# Altium schematic sheet Audio.SchDoc
size B; SheetNumber: 6; SheetTotal: 8
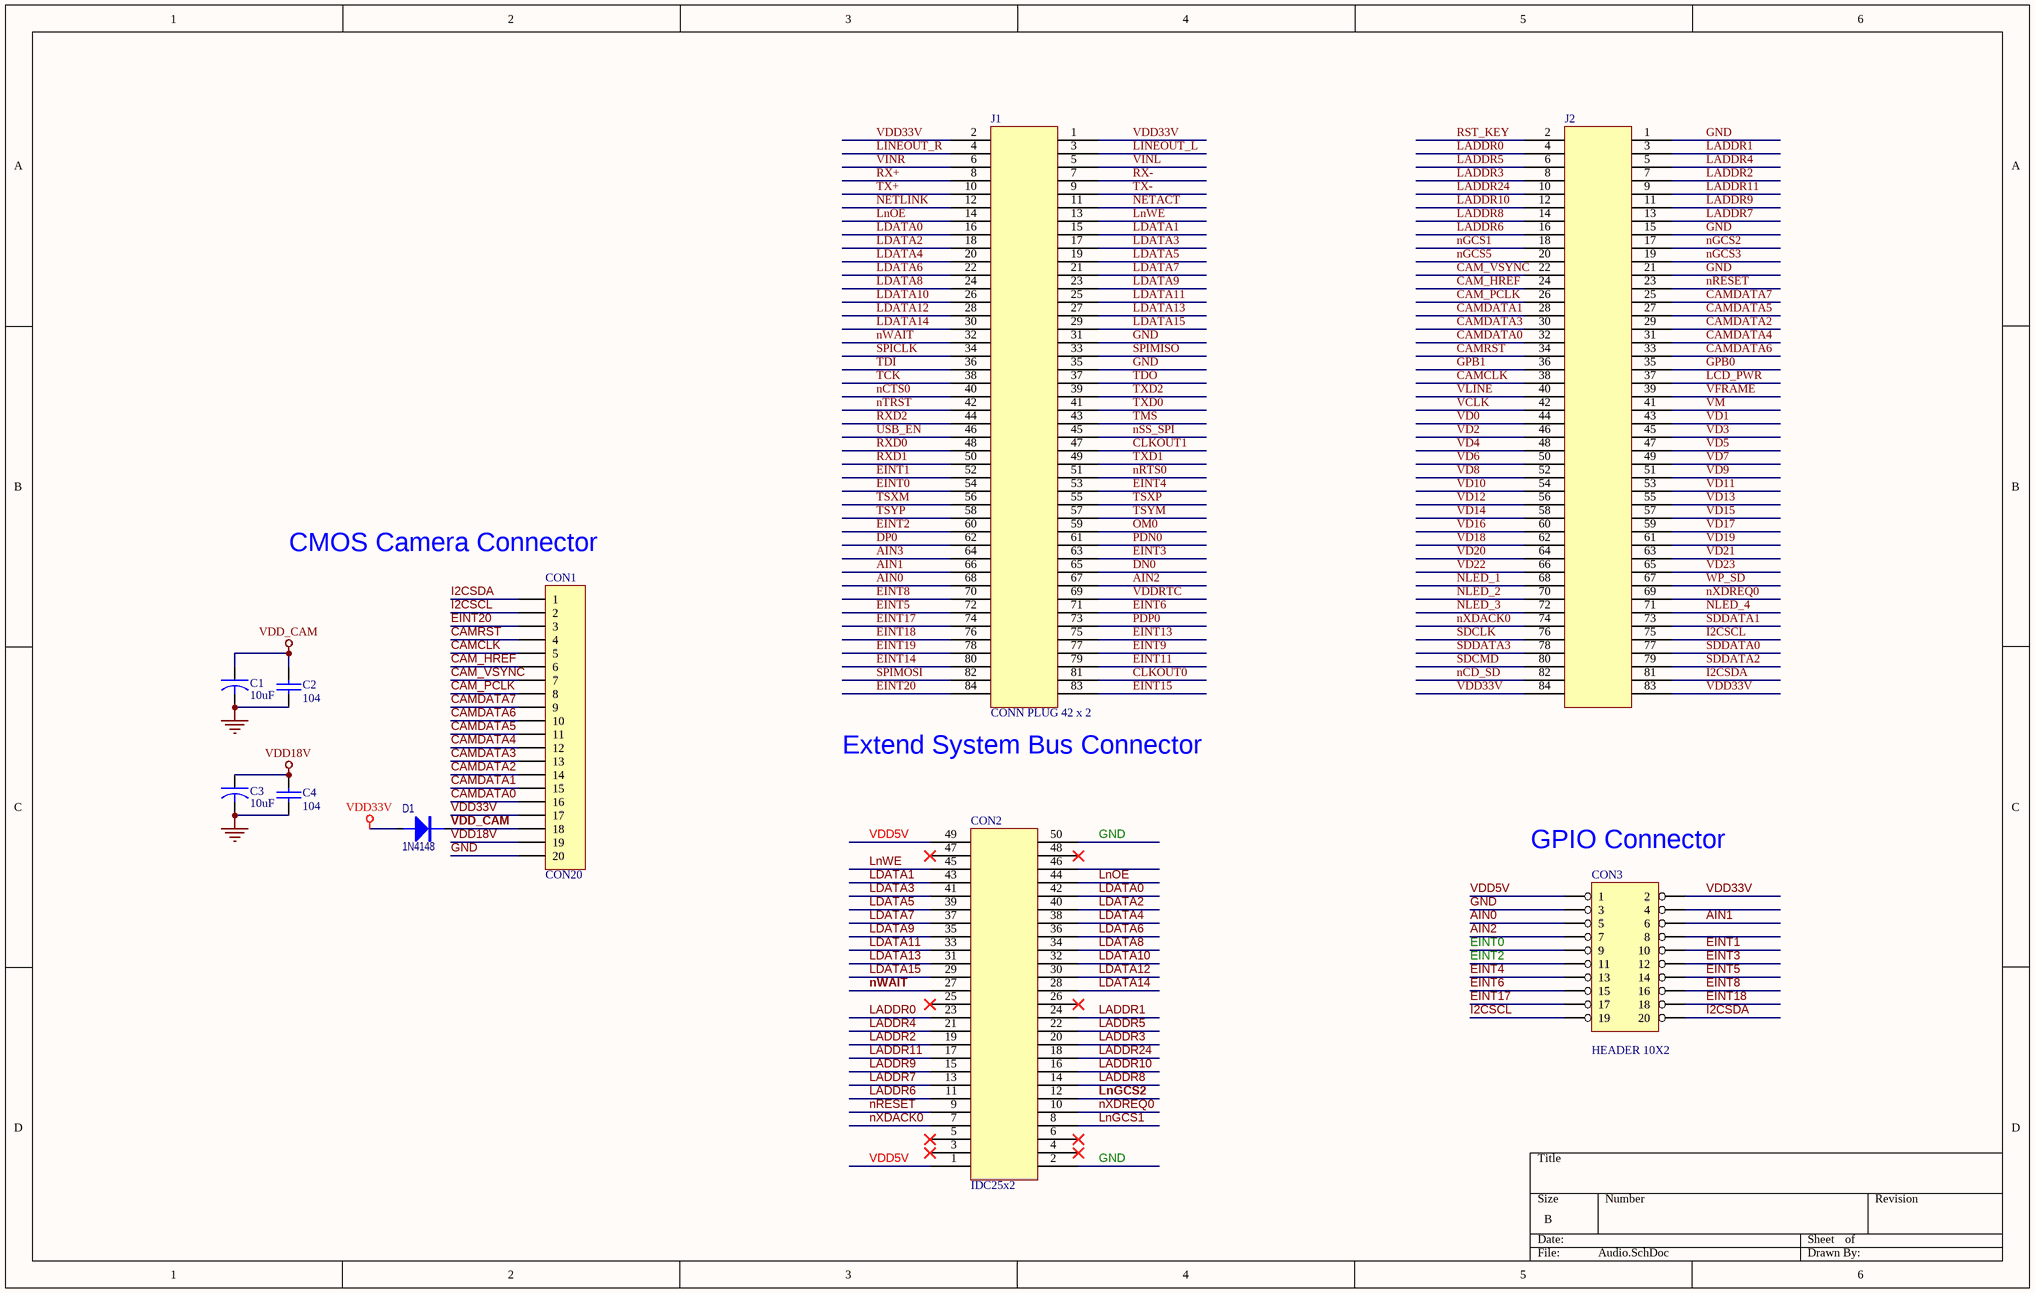
[diagram p0: Audio.SchDoc]

## Parts
C1  10uF  [3216A]
C2  104  [0603A]
C3  10uF  [3216A]
C4  104  [0603A]
CON1  CON20  [IDC20SS]
CON2  IDC25x2  [IDC25X2]
CON3  HEADER 10X2  [IDC20SS]
D1  1N4148  [D1206]
J1  CONN PLUG 42 x 2  [DIP84]
J2  CONN PLUG 42 x 2  [DIP84]  (value not drawn)

## Nets
GND: C1.2 C2.2 C3.2 C4.2 CON1.20 CON2.2 CON2.50 CON3.3 J1.31 J1.35 J2.1 J2.15 J2.21
VDD18V: C3.1 C4.1 CON1.19
VDD33V: CON1.17 CON3.2 D1.1 J1.1 J1.2 J2.83 J2.84
VDD_CAM: C1.1 C2.1 CON1.18 D1.2
AIN0: CON3.5 J1.68
AIN1: CON3.6 J1.66
AIN2: CON3.7 J1.67
AIN3: J1.64
CAM_HREF: CON1.6 J2.24
CAM_PCLK: CON1.8 J2.26
CAM_VSYNC: CON1.7 J2.22
CAMCLK: CON1.5 J2.38
CAMDATA0: CON1.16 J2.32
CAMDATA1: CON1.15 J2.28
CAMDATA2: CON1.14 J2.29
CAMDATA3: CON1.13 J2.30
CAMDATA4: CON1.12 J2.31
CAMDATA5: CON1.11 J2.27
CAMDATA6: CON1.10 J2.33
CAMDATA7: CON1.9 J2.25
CAMRST: CON1.4 J2.34
CLKOUT0: J1.81
CLKOUT1: J1.47
DN0: J1.65
DP0: J1.62
EINT0: CON3.9 J1.54
EINT1: CON3.10 J1.52
EINT2: CON3.11 J1.60
EINT3: CON3.12 J1.63
EINT4: CON3.13 J1.53
EINT5: CON3.14 J1.72
EINT6: CON3.15 J1.71
EINT8: CON3.16 J1.70
EINT9: J1.77
EINT11: J1.79
EINT13: J1.75
EINT14: J1.80
EINT15: J1.83
EINT17: CON3.17 J1.74
EINT18: CON3.18 J1.76
EINT19: J1.78
EINT20: CON1.3 J1.84
GPB0: J2.35
GPB1: J2.36
I2CSCL: CON1.2 CON3.19 J2.75
I2CSDA: CON1.1 CON3.20 J2.81
LADDR0: CON2.23 J2.4
LADDR1: CON2.24 J2.3
LADDR2: CON2.19 J2.7
LADDR3: CON2.20 J2.8
LADDR4: CON2.21 J2.5
LADDR5: CON2.22 J2.6
LADDR6: CON2.11 J2.16
LADDR7: CON2.13 J2.13
LADDR8: CON2.14 J2.14
LADDR9: CON2.15 J2.11
LADDR10: CON2.16 J2.12
LADDR11: CON2.17 J2.9
LADDR24: CON2.18 J2.10
LCD_PWR: J2.37
LDATA0: CON2.42 J1.16
LDATA1: CON2.43 J1.15
LDATA2: CON2.40 J1.18
LDATA3: CON2.41 J1.17
LDATA4: CON2.38 J1.20
LDATA5: CON2.39 J1.19
LDATA6: CON2.36 J1.22
LDATA7: CON2.37 J1.21
LDATA8: CON2.34 J1.24
LDATA9: CON2.35 J1.23
LDATA10: CON2.32 J1.26
LDATA11: CON2.33 J1.25
LDATA12: CON2.30 J1.28
LDATA13: CON2.31 J1.27
LDATA14: CON2.28 J1.30
LDATA15: CON2.29 J1.29
LINEOUT_L: J1.3
LINEOUT_R: J1.4
LnGCS1: CON2.8
LnGCS2: CON2.12
LnOE: CON2.44 J1.14
LnWE: CON2.45 J1.13
nCD_SD: J2.82
nCTS0: J1.40
NETACT: J1.11
NETLINK: J1.12
nGCS1: J2.18
nGCS2: J2.17
nGCS3: J2.19
nGCS5: J2.20
NLED_1: J2.68
NLED_2: J2.70
NLED_3: J2.72
NLED_4: J2.71
nRESET: CON2.9 J2.23
nRTS0: J1.51
nSS_SPI: J1.45
nTRST: J1.42
nWAIT: CON2.27 J1.32
nXDACK0: CON2.7 J2.74
nXDREQ0: CON2.10 J2.69
OM0: J1.59
PDN0: J1.61
PDP0: J1.73
RST_KEY: J2.2
RX+: J1.8
RX-: J1.7
RXD0: J1.48
RXD1: J1.50
RXD2: J1.44
SDCLK: J2.76
SDCMD: J2.80
SDDATA0: J2.77
SDDATA1: J2.73
SDDATA2: J2.79
SDDATA3: J2.78
SPICLK: J1.34
SPIMISO: J1.33
SPIMOSI: J1.82
TCK: J1.38
TDI: J1.36
TDO: J1.37
TMS: J1.43
TSXM: J1.56
TSXP: J1.55
TSYM: J1.57
TSYP: J1.58
TX+: J1.10
TX-: J1.9
TXD0: J1.41
TXD1: J1.49
TXD2: J1.39
USB_EN: J1.46
VCLK: J2.42
VD0: J2.44
VD1: J2.43
VD2: J2.46
VD3: J2.45
VD4: J2.48
VD5: J2.47
VD6: J2.50
VD7: J2.49
VD8: J2.52
VD9: J2.51
VD10: J2.54
VD11: J2.53
VD12: J2.56
VD13: J2.55
VD14: J2.58
VD15: J2.57
VD16: J2.60
VD17: J2.59
VD18: J2.62
VD19: J2.61
VD20: J2.64
VD21: J2.63
VD22: J2.66
VD23: J2.65
VDD5V: CON2.1 CON2.49 CON3.1
VDDRTC: J1.69
VFRAME: J2.39
VINL: J1.5
VINR: J1.6
VLINE: J2.40
VM: J2.41
WP_SD: J2.67

Not connected (* = marked no-connect by the designer): CON2 3* 4* 5* 6* 25* 26* 46 47* 48*; CON3 4 8

## Notes on the sheet
- (near CON1) CMOS Camera Connector
- (near J1) Extend System Bus Connector
- (near CON3) GPIO Connector

## Library data of the parts
C1 C3 = CAPACITOR
C2 C4 = CAP: Capacitor
CON1 = CON20: Connector
D1 = DIODE